# Altium schematic sheet interface.SchDoc
size 381 x 241 mm; SheetNumber: 1; SheetTotal: 4
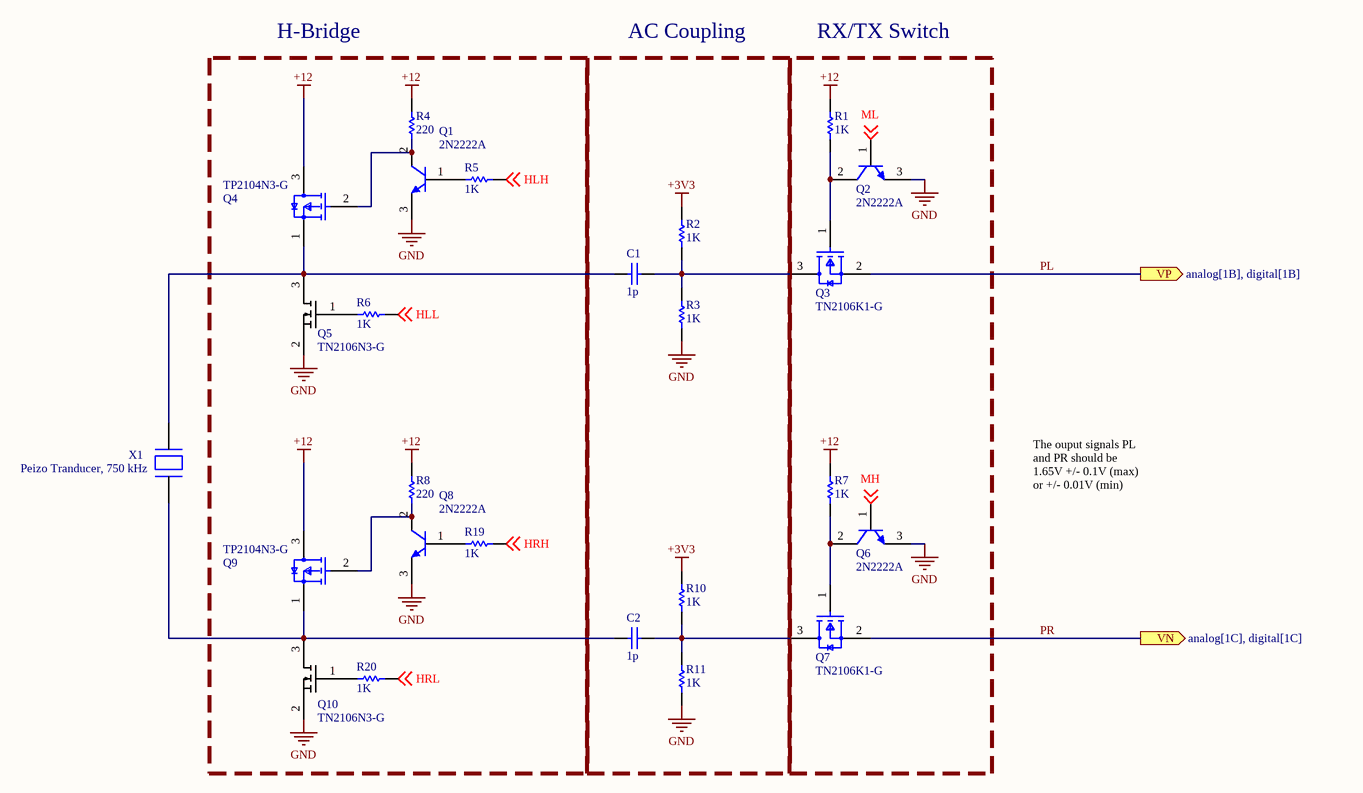
[diagram p0: interface.SchDoc]

## Parts
C1  value 1p  (hidden comment: Capacitor)
C2  value 1p  (hidden comment: Capacitor)
Q1  2N2222A  [STM-TO-18-3]
Q2  2N2222A  [STM-TO-18-3]
Q3  TN2106K1-G  [FP-K1-T-IPC_A]
Q4  TP2104N3-G  [FP-TP2104N3-G-MFG]
Q5  TN2106N3-G
Q6  2N2222A  [STM-TO-18-3]
Q7  TN2106K1-G  [FP-K1-T-IPC_A]
Q8  2N2222A  [STM-TO-18-3]
Q9  TP2104N3-G  [FP-TP2104N3-G-MFG]
Q10  TN2106N3-G
R1  value 1K  (hidden comment: Resistor)
R2  value 1K  (hidden comment: Resistor)
R3  value 1K  (hidden comment: Resistor)
R4  value 220  (hidden comment: Resistor)
R5  value 1K  (hidden comment: Resistor)
R6  value 1K  (hidden comment: Resistor)
R7  value 1K  (hidden comment: Resistor)
R8  value 220  (hidden comment: Resistor)
R10  value 1K  (hidden comment: Resistor)
R11  value 1K  (hidden comment: Resistor)
R19  value 1K  (hidden comment: Resistor)
R20  value 1K  (hidden comment: Resistor)
X1  Peizo Tranducer, 750 kHz

## Blocks framed on the sheet
H-Bridge: Q1 Q4 Q5 Q8-Q10 R4-R6 R8 R19 R20
AC Coupling: C1 C2 R2 R3 R10 R11
RX/TX Switch: Q2 Q3 Q6 Q7 R1 R7

## Ports
VN (out, see analog[1C], digital[1C]), VP (out, see analog[1B], digital[1B])

## Nets
+3V3: R2.2 R10.2
+12: Q4.3(Drain) Q9.3(Drain) R1.2 R4.2 R7.2 R8.2
GND: Q1.3(E) Q2.3(E) Q5.2(S) Q6.3(E) Q8.3(E) Q10.2(S) R3.1 R11.1
HLH: R5.1 ; off-sheet HLH
HLL: R6.1 ; off-sheet HLL
HRH: R19.1 ; off-sheet HRH
HRL: R20.1 ; off-sheet HRL
MH: Q6.1(B) ; off-sheet MH
ML: Q2.1(B) ; off-sheet ML
PL: Q3.2(Source) ; port VP
PR: Q7.2(Source) ; port VN
NetC1_1: C1.1 Q4.1(Source) Q5.3(D) X1.1
NetC1_2: C1.2 Q3.3(Drain) R2.1 R3.2
NetC2_1: C2.1 Q9.1(Source) Q10.3(D) X1.2
NetC2_2: C2.2 Q7.3(Drain) R10.1 R11.2
NetQ1_1: Q1.1(B) R5.2
NetQ1_2: Q1.2(C) Q4.2(Gate) R4.1
NetQ2_2: Q2.2(C) Q3.1(Gate) R1.1
NetQ5_1: Q5.1(G) R6.2
NetQ6_2: Q6.2(C) Q7.1(Gate) R7.1
NetQ8_1: Q8.1(B) R19.2
NetQ8_2: Q8.2(C) Q9.2(Gate) R8.1
NetQ10_1: Q10.1(G) R20.2

## Notes on the sheet
- The ouput signals PL and PR should be 1.65V +/- 0.1V (max) or +/- 0.01V (min)

## Library data of the parts
C1 C2 = Capacitor: SimulationGenericComponent: True
Q1 Q2 Q6 Q8 = CMP-2000-05381-1: High Speed Switch, 0.6 A IC, -65 to 175 degC, 3-Pin TO-18, RoHS, Bulk; Manufacturer: STMicroelectronics; Power Dissipation Pd: 500mW; DC Current Gain hFE: 300hFE; Transistor Polarity: NPN; DC Collector Current: 600mA; No. of Pins: 3Pins; Transition Frequency ft: 300MHz; Collector Emitter Voltage V(br)ceo: 40V; Product Range: -; Package Reference: TO-18-3; Datasheet URL: https://datasheet.ciiva.com/25917/cd00003223-25917094.pdf; Automotive Qualification Standard: -; Transistor Case Style: TO-18; Operating Temperature Max: 175degC; Datasheet Version: Feb-03; Package Description: 3-Pin Through Hole Device, Dia 5.8 mm, Pitch 1.27 mm; Manufacturer URL: http://www.st.com/
Q3 Q7 = CMP-06369-000018-1: MOSFET N-CH 60V 280MA SOT23-3; Input Capacitance: 50pF; Turn-On Delay Time: 3ns; Number of Elements: 1; Power Dissipation: 360mW; Drain to Source Resistance: 2.5R; Fall Time: 5ns; Turn-Off Delay Time: 6ns; Gate to Source Voltage (Vgs): 20V; Polarity: N-CHANNEL; Element Configuration: Single; Min Operating Temperature: -55°C; Height: 0.95mm; Width: 1.3mm; Radiation Hardening: No; Mount: Surface Mount; Weight: 0.050717oz; Rds On Max: 2.5R; Packaging: Tape and Reel; Contact Plating: Tin; Package Quantity: 3000; Max Power Dissipation: 360mW; Number of Channels: 1; Drain to Source Breakdown Voltage: 60V; Max Operating Temperature: 150°C; Rise Time: 5ns; Case/Package: SOT-23; Continuous Drain Current (ID): 280mA; Number of Pins: 3; Series: -; Length: 2.9mm
Q4 Q9 = CMP-06369-000017-1: MOSFET P-CH 40V 175MA TO92-3; Turn-On Delay Time: 4ns; Drain to Source Resistance: 6R; Element Configuration: Single; Gate to Source Voltage (Vgs): 20V; Drain to Source Breakdown Voltage: -40V; Max Power Dissipation: 740mW; Number of Channels: 1; Input Capacitance: 60pF; Turn-Off Delay Time: 5ns; Polarity: P-CHANNEL; Max Operating Temperature: 150°C; Lead Free: Lead Free; Series: -; Mount: Through Hole; Number of Pins: 3; Min Operating Temperature: -55°C; Case/Package: TO-92-3; RoHS Compliant: Yes; Length: 5.21mm; Continuous Drain Current (ID): 175mA; Height: 5.33mm; Package Quantity: 1000; Drain to Source Voltage (Vdss): 40V; Rise Time: 4ns; Packaging: Bulk; Power Dissipation: 740mW; Fall Time: 4ns; Weight: 0.016oz; Width: 4.19mm; Rds On Max: 6R
Q5 Q10 = TN2106N3-G: Small Signal Field-Effect Transistor, 1.2A I(D), 100V, 1-Element, N-Channel, Silicon, Metal-oxide Semiconductor FET, TO-92; Manufacturer: Microchip Supertex; Package Body Material: Plastic; Drain Current-Max (Abs) (ID): 300mA; Drain-source On Resistance-Max: 2.5R; DS Breakdown Voltage-Min: 60V; Feedback Cap-Max (Crss): 8pF; Number of Elements: 1; Operating Mode: ENHANCEMENT MODE; Power Dissipation-Max (Abs): 740mW; Surface Mount: No; Transistor Application: SWITCHING; Qualification Status: Not Qualified; Supplier: Digikey; Supplier Part Number: TN2106N3-G-ND; Manufacturer Part Number: TN2106N3-G; RoHS: Yes; Category: MOSFETs; Stock: 1423; Pricing: 1=0.68, 25=0.56, 100=0.52 (USD); Pins: 3; Package Shape: Round; Terminal Finish: Tin; Transistor Element Material: SILICON; Max Operating Temperature: 150°C; JESD-609 Code: e3; Polarity/Channel Type: N-CHANNEL; Drain Current-Max (ID): 300mA; FET Technology: METAL-OXIDE SEMICONDUCTOR; JESD-30 Code: O-PBCY-T3; Package Style: CYLINDRICALMeter; Terminal Form: Through Hole; Terminal Position: BOTTOM; JEDEC-95 Code: TO-92; Reach SVHC Compliant: Yes; RoHS Compliant: Yes; ComponentLink1URL: https://datasheet.ciiva.com:443/pdfs/VipMasterIC/IC/SUPR/SUPRS03953/SUPRS03953-1.pdf?src-supplier=IHS+Markit; ComponentLink1Description: https://datasheet.ciiva.com:443/pdfs/VipMasterIC/IC/SUPR/SUPRS03953/SUPRS03953-1.pdf?src-supplier=IHS+Markit; ComponentLink2URL: https://datasheet.ciiva.com/16232/tn2106-16232278.pdf?src-supplier=Onlinecomponents.com; ComponentLink2Description: https://datasheet.ciiva.com/16232/tn2106-16232278.pdf?src-supplier=Onlinecomponents.com; ComponentLink3URL: https://datasheet.ciiva.com/30180/14tn2106-30180231.pdf?src-supplier=Onlinecomponents.com; ComponentLink3Description: https://datasheet.ciiva.com/30180/14tn2106-30180231.pdf?src-supplier=Onlinecomponents.com
R1-R8 R10 R11 R19 R20 = Resistor: TC1: 0; SimulationGenericComponent: True; TC2: 0
X1 = SMD20T27F750S